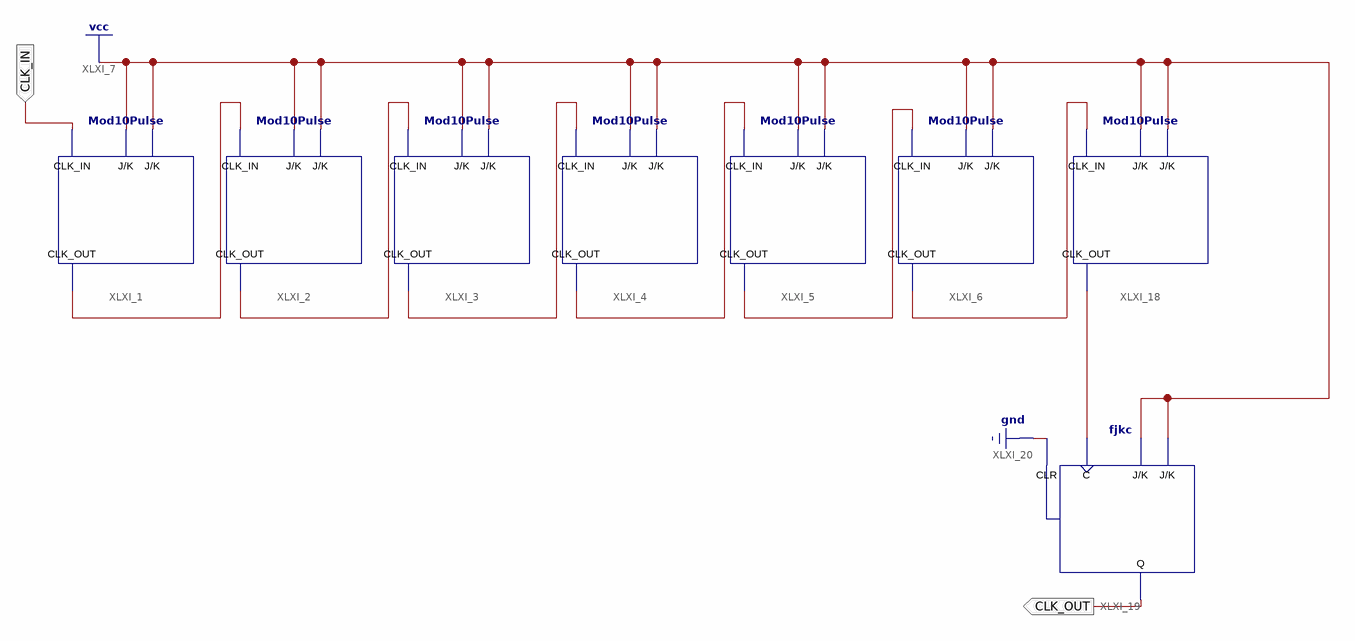
[diagram p0: schematic sheet 1]
// Xilinx ISE schematic OneHz.sch (spartan6) as structural Verilog: 8 symbols, 2 ports
module OneHz (
  input  CLK_IN,
  output CLK_OUT
);

  wire XLXN_107, XLXN_108, XLXN_109, XLXN_110, XLXN_111, XLXN_131, XLXN_153;

  Mod10Pulse XLXI_4 (.CLK_IN(XLXN_109), .J(1'b1), .K(1'b1), .CLK_OUT(XLXN_110));
  Mod10Pulse XLXI_3 (.CLK_IN(XLXN_108), .J(1'b1), .K(1'b1), .CLK_OUT(XLXN_109));
  Mod10Pulse XLXI_5 (.CLK_IN(XLXN_110), .J(1'b1), .K(1'b1), .CLK_OUT(XLXN_111));
  Mod10Pulse XLXI_1 (.CLK_IN(CLK_IN), .J(1'b1), .K(1'b1), .CLK_OUT(XLXN_107));
  Mod10Pulse XLXI_2 (.CLK_IN(XLXN_107), .J(1'b1), .K(1'b1), .CLK_OUT(XLXN_108));
  Mod10Pulse XLXI_6 (.CLK_IN(XLXN_111), .J(1'b1), .K(1'b1), .CLK_OUT(XLXN_131));
  Mod10Pulse XLXI_18 (.CLK_IN(XLXN_131), .J(1'b1), .K(1'b1), .CLK_OUT(XLXN_153));
  fjkc XLXI_19 (.C(XLXN_153), .CLR(1'b0), .J(1'b1), .K(1'b1), .Q(CLK_OUT));
endmodule
